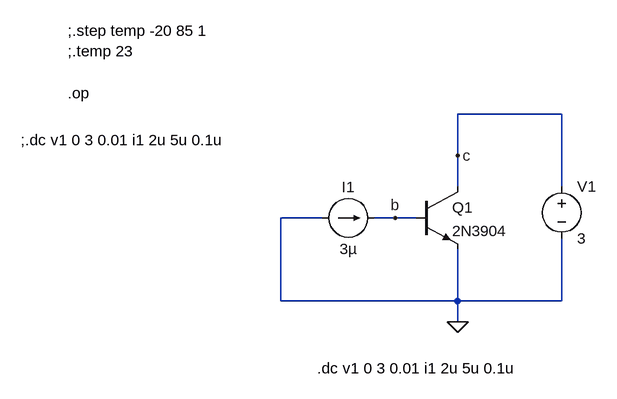
[diagram p0: schematic 01-biasing_2N3904.asc]
01-biasing_2N3904.asc, the LTspice schematic file:
Version 4
SHEET 1 880 680
WIRE 32 48 -128 48
WIRE -128 112 -128 48
WIRE -128 160 -128 112
WIRE 32 160 32 48
WIRE -336 208 -400 208
WIRE -224 208 -256 208
WIRE -192 208 -224 208
WIRE -400 336 -400 208
WIRE -128 336 -128 256
WIRE -128 336 -400 336
WIRE 32 336 32 240
WIRE 32 336 -128 336
WIRE -128 368 -128 336
FLAG -128 368 0
FLAG -128 112 c
FLAG -224 208 b
SYMBOL voltage 32 144 R0
WINDOW 123 0 0 Left 0
WINDOW 39 0 0 Left 0
SYMATTR InstName V1
SYMATTR Value 3
SYMBOL current -336 208 R270
WINDOW 0 32 40 VTop 2
WINDOW 3 -32 40 VBottom 2
WINDOW 123 0 0 Left 0
WINDOW 39 0 0 Left 0
SYMATTR InstName I1
SYMATTR Value 3µ
SYMBOL npn -192 160 R0
SYMATTR InstName Q1
SYMATTR Value 2N3904
TEXT -344 440 Left 2 !.dc v1 0 3 0.01 i1 2u 5u 0.1u
TEXT -728 -80 Left 2 !;.step temp -20 85 1\n;.temp 23
TEXT -728 16 Left 2 !.op
TEXT -800 88 Left 2 !;.dc v1 0 3 0.01 i1 2u 5u 0.1u

The netlist it stands for:
* 01-biasing_2N3904.asc
V1 c 0 3
I1 0 b 3µ
Q1 c b 0 0 2N3904
.model NPN NPN
.model PNP PNP
.lib standard.bjt
.dc v1 0 3 0.01 i1 2u 5u 0.1u
;.step temp -20 85 1
;.temp 23
.op
;.dc v1 0 3 0.01 i1 2u 5u 0.1u
.backanno
.end

* Results of the author's LTspice run, read from the files saved beside the schematic
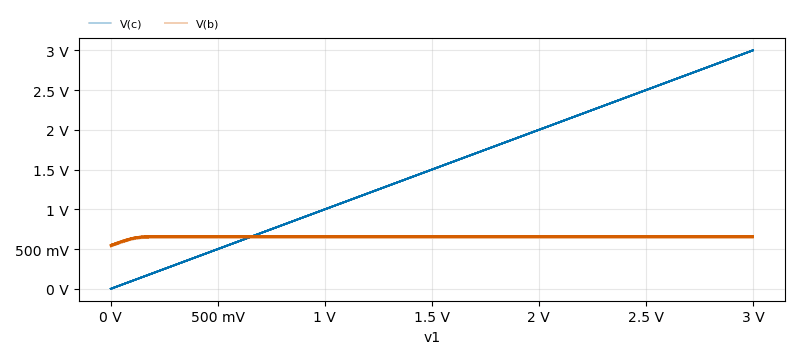
[diagram p1: DC transfer characteristic of 01-biasing_2N3904.asc, plotted from the saved traces]
* DC transfer characteristic, 31 runs:
*   V(c) [run 1]: 0 V at v1=0 V, 3 V at v1=3 V, min 0 V, max 3 V
*   V(c) [run 2]: 0 V at v1=0 V, 3 V at v1=3 V, min 0 V, max 3 V
*   V(c) [run 3]: 0 V at v1=0 V, 3 V at v1=3 V, min 0 V, max 3 V
*   V(c) [run 4]: 0 V at v1=0 V, 3 V at v1=3 V, min 0 V, max 3 V
*   V(c) [run 5]: 0 V at v1=0 V, 3 V at v1=3 V, min 0 V, max 3 V
*   V(c) [run 6]: 0 V at v1=0 V, 3 V at v1=3 V, min 0 V, max 3 V
*   V(c) [run 7]: 0 V at v1=0 V, 3 V at v1=3 V, min 0 V, max 3 V
*   V(c) [run 8]: 0 V at v1=0 V, 3 V at v1=3 V, min 0 V, max 3 V
*   V(b) [run 1]: 529.9 mV at v1=0 V, 642 mV at v1=3 V, min 529.9 mV, max 642 mV
*   V(b) [run 2]: 532.4 mV at v1=0 V, 644.5 mV at v1=3 V, min 532.4 mV, max 644.5 mV
*   V(b) [run 3]: 534.7 mV at v1=0 V, 646.7 mV at v1=3 V, min 534.7 mV, max 646.7 mV
*   V(b) [run 4]: 536.7 mV at v1=0 V, 648.8 mV at v1=3 V, min 536.7 mV, max 648.8 mV
*   V(b) [run 5]: 538.7 mV at v1=0 V, 650.8 mV at v1=3 V, min 538.7 mV, max 650.8 mV
*   V(b) [run 6]: 540.4 mV at v1=0 V, 652.5 mV at v1=3 V, min 540.4 mV, max 652.5 mV
*   V(b) [run 7]: 542.1 mV at v1=0 V, 654.2 mV at v1=3 V, min 542.1 mV, max 654.2 mV
*   V(b) [run 8]: 543.7 mV at v1=0 V, 655.8 mV at v1=3 V, min 543.7 mV, max 655.8 mV